# Altium schematic sheet A_OUTPUT.SchDoc
size A3; SheetNumber: 8; SheetTotal: 10
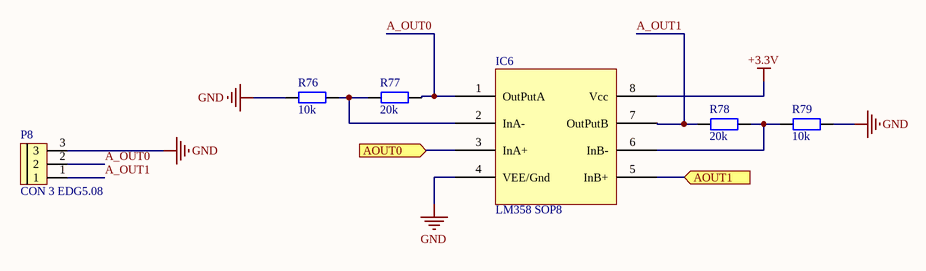
[diagram p0: A_OUTPUT.SchDoc]

## Parts
IC6  LM358 SOP8  [SOP 8]
P8  CON 3 EDG5.08  [CON 3 3EDG5.08]
R76  10k  [tro smd 0805]
R77  20k  [tro smd 0805]
R78  20k  [tro smd 0805]
R79  10k  [tro smd 0805]

## Ports
AOUT0 (in), AOUT1 (in)

## Nets
+3.3V: IC6.8(Vcc)
GND: IC6.4(VEE/Gnd) P8.3 R76.1 R79.1
A_OUT0: IC6.1(OutPutA) P8.2 R77.2
A_OUT1: IC6.7(OutPutB) P8.1 R78.2
AOUT0: IC6.3(InA+) ; port AOUT0
AOUT1: IC6.5(InB+) ; port AOUT1
NetIC6_2: IC6.2(InA-) R76.2 R77.1
NetIC6_6: IC6.6(InB-) R78.1 R79.2

## Library data of the parts
IC6 = LM358 SOP8: Dán; Ma_Hang: MH000609; Don_Vi: Con; Ten_Linh_Kien: LM358 SOP8; Kieu_Chan: *; Ghi_Chu: *; Chung_Loai: Dán
P8 = CON 3 EDG5.08: Cắm; Ten_Linh_Kien: CON 3 2EDG5.08-3P 5.08MM ( Xanh Cong); Ma_Hang: MH000760; Ghi_Chu: *; Kieu_Chan: *; Don_Vi: Con; Chung_Loai: Cắm
R76-R79 = Tro 0805 1% 10k: Dán; Don_Vi: Con; So_Chan: 2; Ten_Linh_Kien: Trở 0805 1% 10k; Ma_Hang: MH005473; Chung_Loai: Dán; Kieu_Chan: *